# EAGLE design relay10 (EAGLE 6.0)
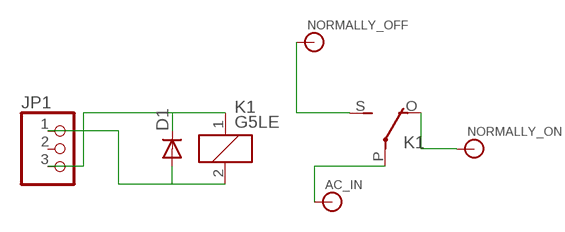
[diagram p0: schematic, sheet 1]

## Parts
AC_IN  BANANA_CONN  [BANANA_CONN]
D1  1N4004  [DO41-10]
JP1  PINHD-1X3  [1X03]
K1  G5LE  [G5LE]
NORMALLY_OFF  BANANA_CONN  [BANANA_CONN]
NORMALLY_ON  BANANA_CONN  [BANANA_CONN]

## Nets
N$1: D1.A JP1.1 K1.2
N$2: D1.C JP1.3 K1.1
N$3: K1.S(2:S) NORMALLY_OFF.P$1
N$4: K1.O(2:O) NORMALLY_ON.P$1
N$5: AC_IN.P$1 K1.P(2:P)
Unconnected: JP1.2

## Library data of the parts
AC_IN NORMALLY_OFF NORMALLY_ON = SparkFun-Connectors:BANANA_CONN: Through-hole banana jack
D1 = diode:1N4004: DIODE general purpose rectifier, 1 A
JP1 = adafruit:PINHD-1X3: PIN HEADER
K1 = relay:G5LE: RELAY 1 x switch, 10 A/120 V AC, 8 A/30 V DC, Omron; OC_FARNELL: unknown; OC_NEWARK: unknown

## Board
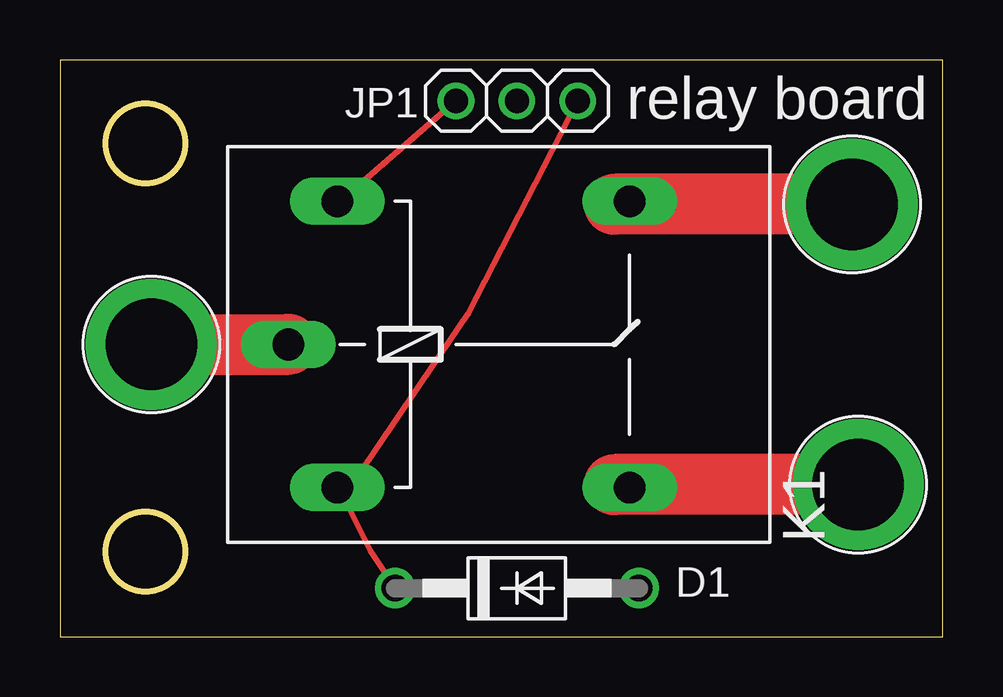
[diagram p1: board, top side]
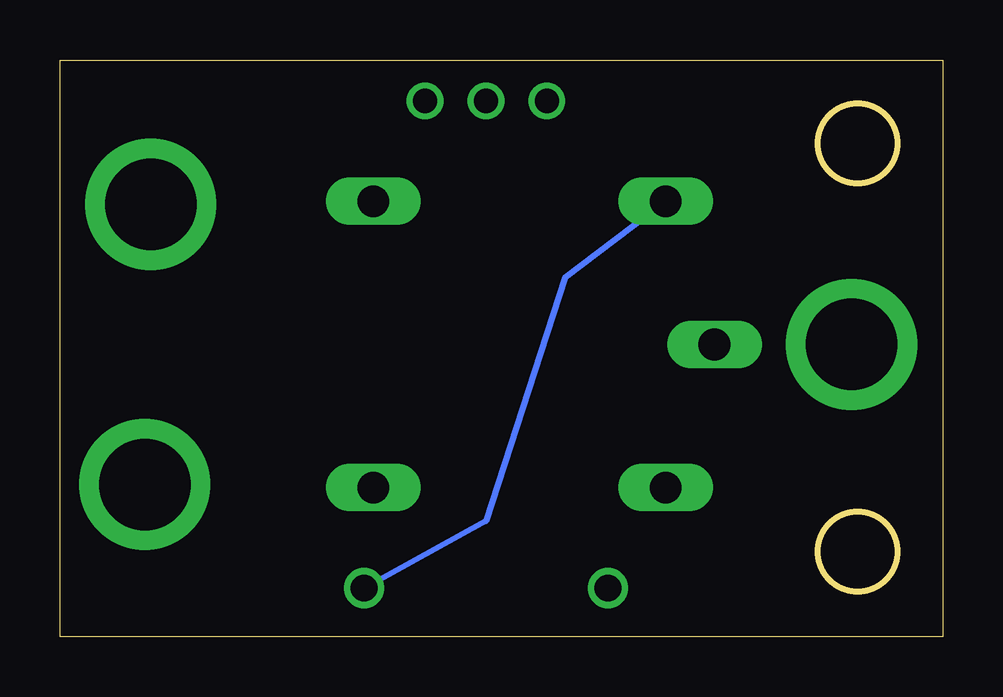
[diagram p2: board, bottom side, seen from below]

Size 36.81 x 24.05 mm. Coordinates in mm from the lower left corner, seen from the top.
Outline: 0,0 36.81,0 36.81,24.05 0,24.05 0,0
Outline: circle at 3.56,20.57 radius 1.65
Outline: circle at 3.56,3.56 radius 1.65
Copper layers (1*16): Top 0.035mm / dielectric 1.5mm / Bottom 0.035mm
Design rules: minimum track width 10mil, minimum drill 24mil, track to track 8mil, track to pad 8mil, pad to pad 8mil, via to via 8mil, smd to smd 8mil, copper to edge 40mil, drill to drill 8mil, minimum pad ring 10mil, minimum via ring 8mil, stop-mask expansion 4mil, vias tented up to drill 0mil, thermal gap 10mil

### Footprints (pad centres in the part's own frame; a part is rotated, then mirrored left to right if it is on the bottom)
BANANA_CONN = drill 3.81 pad 5.461: P$1 0,0
DO41-10 = drill 1.118: A 5.08,0; C -5.08,0
1X03 = drill 1.016: 1 -2.54,0; 2 0,0; 3 2.54,0
G5LE = drill 1.321 long: 1 -7.493,-5.969; 2 -7.493,5.969; O 4.699,5.969; P -9.525,0; S 4.699,-5.969

### Placement (x,y rotation side)
AC_IN  3.81,12.19 0 top
D1  19.05,2.03 0 top
JP1  19.05,22.35 0 top
K1  19.05,12.19 0 top
NORMALLY_OFF  33.27,6.35 0 top
NORMALLY_ON  33.02,18.03 0 top

### Tracks (layer width: path | path; a pad name or v marks a point on that pad's centre or on a via)
N$1
  Top 0.254: JP1.1 12.7,19.05 K1.2
  Bottom 0.254: D1.A 19.05,4.83 15.75,14.99 K1.2
N$2
  Top 0.254: JP1.3 17.02,13.46 12.7,7.11 K1.1 11.68,6.1 12.95,3.56 D1.C
N$3
  Top 0.254: 23.11,6.35 K1.S
  Top 2.54: NORMALLY_OFF.P$1 23.11,6.35
N$4
  Top 0.254: 23.11,18.03 K1.O
  Top 2.54: NORMALLY_ON.P$1 23.11,18.03
N$5
  Top 2.54: AC_IN.P$1 K1.P

### Text on the board
tPlace: relay board